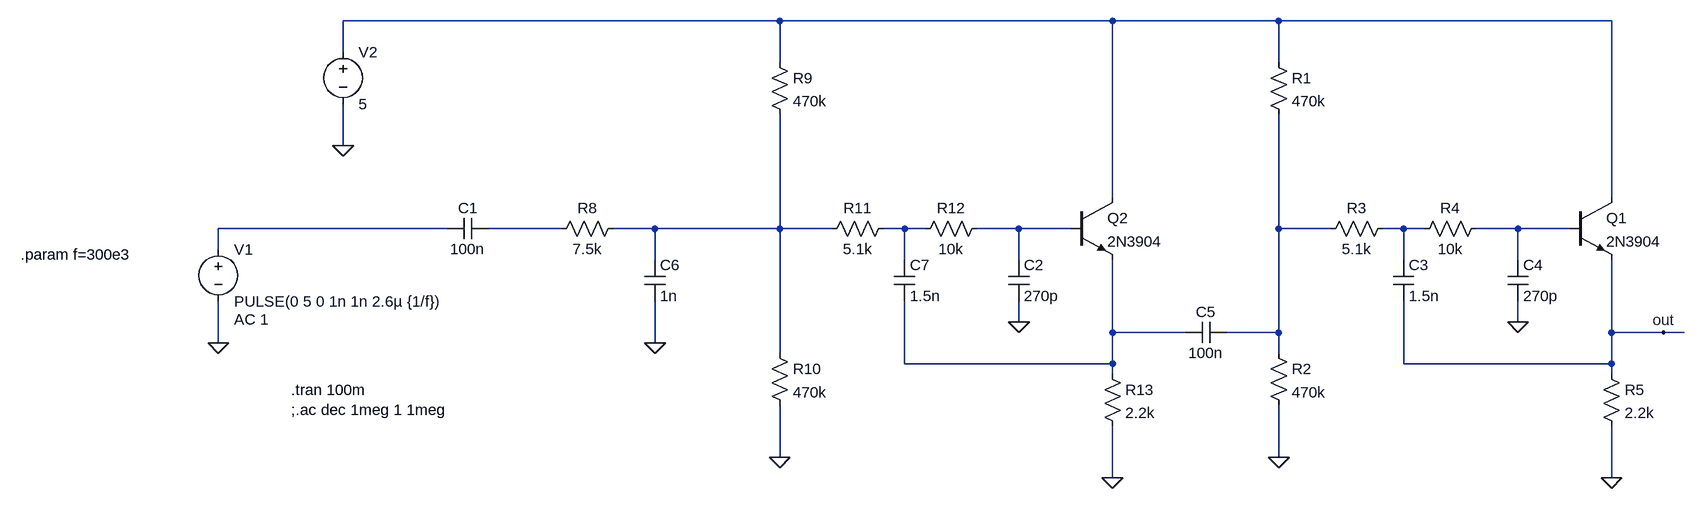
[diagram p0: schematic SallenKey_20kHz.asc]
SallenKey_20kHz.asc, the LTspice schematic file:
Version 4
SHEET 1 2340 680
WIRE 368 -256 -304 -256
WIRE 880 -256 368 -256
WIRE 1136 -256 880 -256
WIRE 1648 -256 1136 -256
WIRE -304 -208 -304 -256
WIRE 368 -192 368 -256
WIRE 1136 -192 1136 -256
WIRE -304 -64 -304 -128
WIRE 880 16 880 -256
WIRE 1648 16 1648 -256
WIRE -144 64 -496 64
WIRE 32 64 -80 64
WIRE 176 64 112 64
WIRE 368 64 368 -112
WIRE 368 64 176 64
WIRE 448 64 368 64
WIRE 560 64 528 64
WIRE 592 64 560 64
WIRE 736 64 672 64
WIRE 816 64 736 64
WIRE 1136 64 1136 -112
WIRE 1216 64 1136 64
WIRE 1328 64 1296 64
WIRE 1360 64 1328 64
WIRE 1504 64 1440 64
WIRE 1584 64 1504 64
WIRE -496 96 -496 64
WIRE 176 112 176 64
WIRE 560 112 560 64
WIRE 736 112 736 64
WIRE 1328 112 1328 64
WIRE 1504 112 1504 64
WIRE 736 208 736 176
WIRE 1504 208 1504 176
WIRE 880 224 880 112
WIRE 992 224 880 224
WIRE 1136 224 1136 64
WIRE 1136 224 1056 224
WIRE 1648 224 1648 112
WIRE 1728 224 1648 224
WIRE 1760 224 1728 224
WIRE -496 240 -496 176
WIRE 176 240 176 176
WIRE 368 256 368 64
WIRE 1136 256 1136 224
WIRE 560 272 560 176
WIRE 880 272 880 224
WIRE 880 272 560 272
WIRE 1328 272 1328 176
WIRE 1648 272 1648 224
WIRE 1648 272 1328 272
WIRE 880 288 880 272
WIRE 1648 288 1648 272
WIRE 368 416 368 336
WIRE 1136 416 1136 336
WIRE 880 448 880 368
WIRE 1648 448 1648 368
FLAG -304 -64 0
FLAG -496 240 0
FLAG 176 240 0
FLAG 368 416 0
FLAG 736 208 0
FLAG 880 448 0
FLAG 1136 416 0
FLAG 1504 208 0
FLAG 1648 448 0
FLAG 1728 224 out
SYMBOL voltage -496 80 R0
WINDOW 123 24 124 Left 2
WINDOW 39 0 0 Left 0
SYMATTR Value2 AC 1
SYMATTR InstName V1
SYMATTR Value PULSE(0 5 0 1n 1n 2.6µ {1/f})
SYMBOL voltage -304 -224 R0
SYMATTR InstName V2
SYMATTR Value 5
SYMBOL cap -80 48 R90
WINDOW 0 0 32 VBottom 2
WINDOW 3 32 32 VTop 2
SYMATTR InstName C1
SYMATTR Value 100n
SYMBOL res 128 48 R90
WINDOW 0 0 56 VBottom 2
WINDOW 3 32 56 VTop 2
SYMATTR InstName R8
SYMATTR Value 7.5k
SYMBOL cap 160 112 R0
SYMATTR InstName C6
SYMATTR Value 1n
SYMBOL res 352 -208 R0
SYMATTR InstName R9
SYMATTR Value 470k
SYMBOL res 352 240 R0
SYMATTR InstName R10
SYMATTR Value 470k
SYMBOL res 544 48 R90
WINDOW 0 0 56 VBottom 2
WINDOW 3 32 56 VTop 2
SYMATTR InstName R11
SYMATTR Value 5.1k
SYMBOL res 688 48 R90
WINDOW 0 0 56 VBottom 2
WINDOW 3 32 56 VTop 2
SYMATTR InstName R12
SYMATTR Value 10k
SYMBOL cap 544 112 R0
SYMATTR InstName C7
SYMATTR Value 1.5n
SYMBOL npn 816 16 R0
SYMATTR InstName Q2
SYMATTR Value 2N3904
SYMBOL res 864 272 R0
SYMATTR InstName R13
SYMATTR Value 2.2k
SYMBOL cap 720 112 R0
SYMATTR InstName C2
SYMATTR Value 270p
SYMBOL res 1120 -208 R0
SYMATTR InstName R1
SYMATTR Value 470k
SYMBOL res 1120 240 R0
SYMATTR InstName R2
SYMATTR Value 470k
SYMBOL res 1312 48 R90
WINDOW 0 0 56 VBottom 2
WINDOW 3 32 56 VTop 2
SYMATTR InstName R3
SYMATTR Value 5.1k
SYMBOL res 1456 48 R90
WINDOW 0 0 56 VBottom 2
WINDOW 3 32 56 VTop 2
SYMATTR InstName R4
SYMATTR Value 10k
SYMBOL cap 1312 112 R0
SYMATTR InstName C3
SYMATTR Value 1.5n
SYMBOL npn 1584 16 R0
SYMATTR InstName Q1
SYMATTR Value 2N3904
SYMBOL res 1632 272 R0
SYMATTR InstName R5
SYMATTR Value 2.2k
SYMBOL cap 1488 112 R0
SYMATTR InstName C4
SYMATTR Value 270p
SYMBOL cap 1056 208 R90
WINDOW 0 0 32 VBottom 2
WINDOW 3 32 32 VTop 2
SYMATTR InstName C5
SYMATTR Value 100n
TEXT -384 312 Left 2 !.tran 100m\n;.ac dec 1meg 1 1meg
TEXT -800 104 Left 2 !.param f=300e3

The netlist it stands for:
* SallenKey_20kHz.asc
V1 N002 0 PULSE(0 5 0 1n 1n 2.6µ {1/f}) AC 1
V2 N001 0 5
C1 N003 N002 100n
R8 N004 N003 7.5k
C6 N004 0 1n
R9 N001 N004 470k
R10 N004 0 470k
R11 N005 N004 5.1k
R12 N006 N005 10k
C7 N005 N010 1.5n
Q2 N001 N006 N010 0 2N3904
R13 N010 0 2.2k
C2 N006 0 270p
R1 N001 N007 470k
R2 N007 0 470k
R3 N008 N007 5.1k
R4 N009 N008 10k
C3 N008 out 1.5n
Q1 N001 N009 out 0 2N3904
R5 out 0 2.2k
C4 N009 0 270p
C5 N007 N010 100n
.model NPN NPN
.model PNP PNP
.lib standard.bjt
.tran 100m
;.ac dec 1meg 1 1meg
.param f=300e3
.backanno
.end